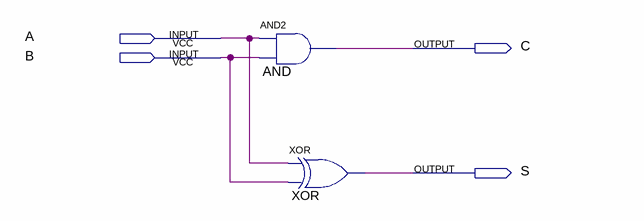
[diagram p0: schematic sheet]
// Quartus schematic halfadder.bdf as structural Verilog: 2 symbols, 4 pins
module halfadder (
  input  A,
  input  B,
  output C,
  output S
);

  and AND (C, A, B);
  xor XOR (S, A, B);
endmodule
